# EAGLE design protoboard_demo.v1.1 (EAGLE 5.07)
PROJECT: Protoboard v1.1 (.500 xQFP)
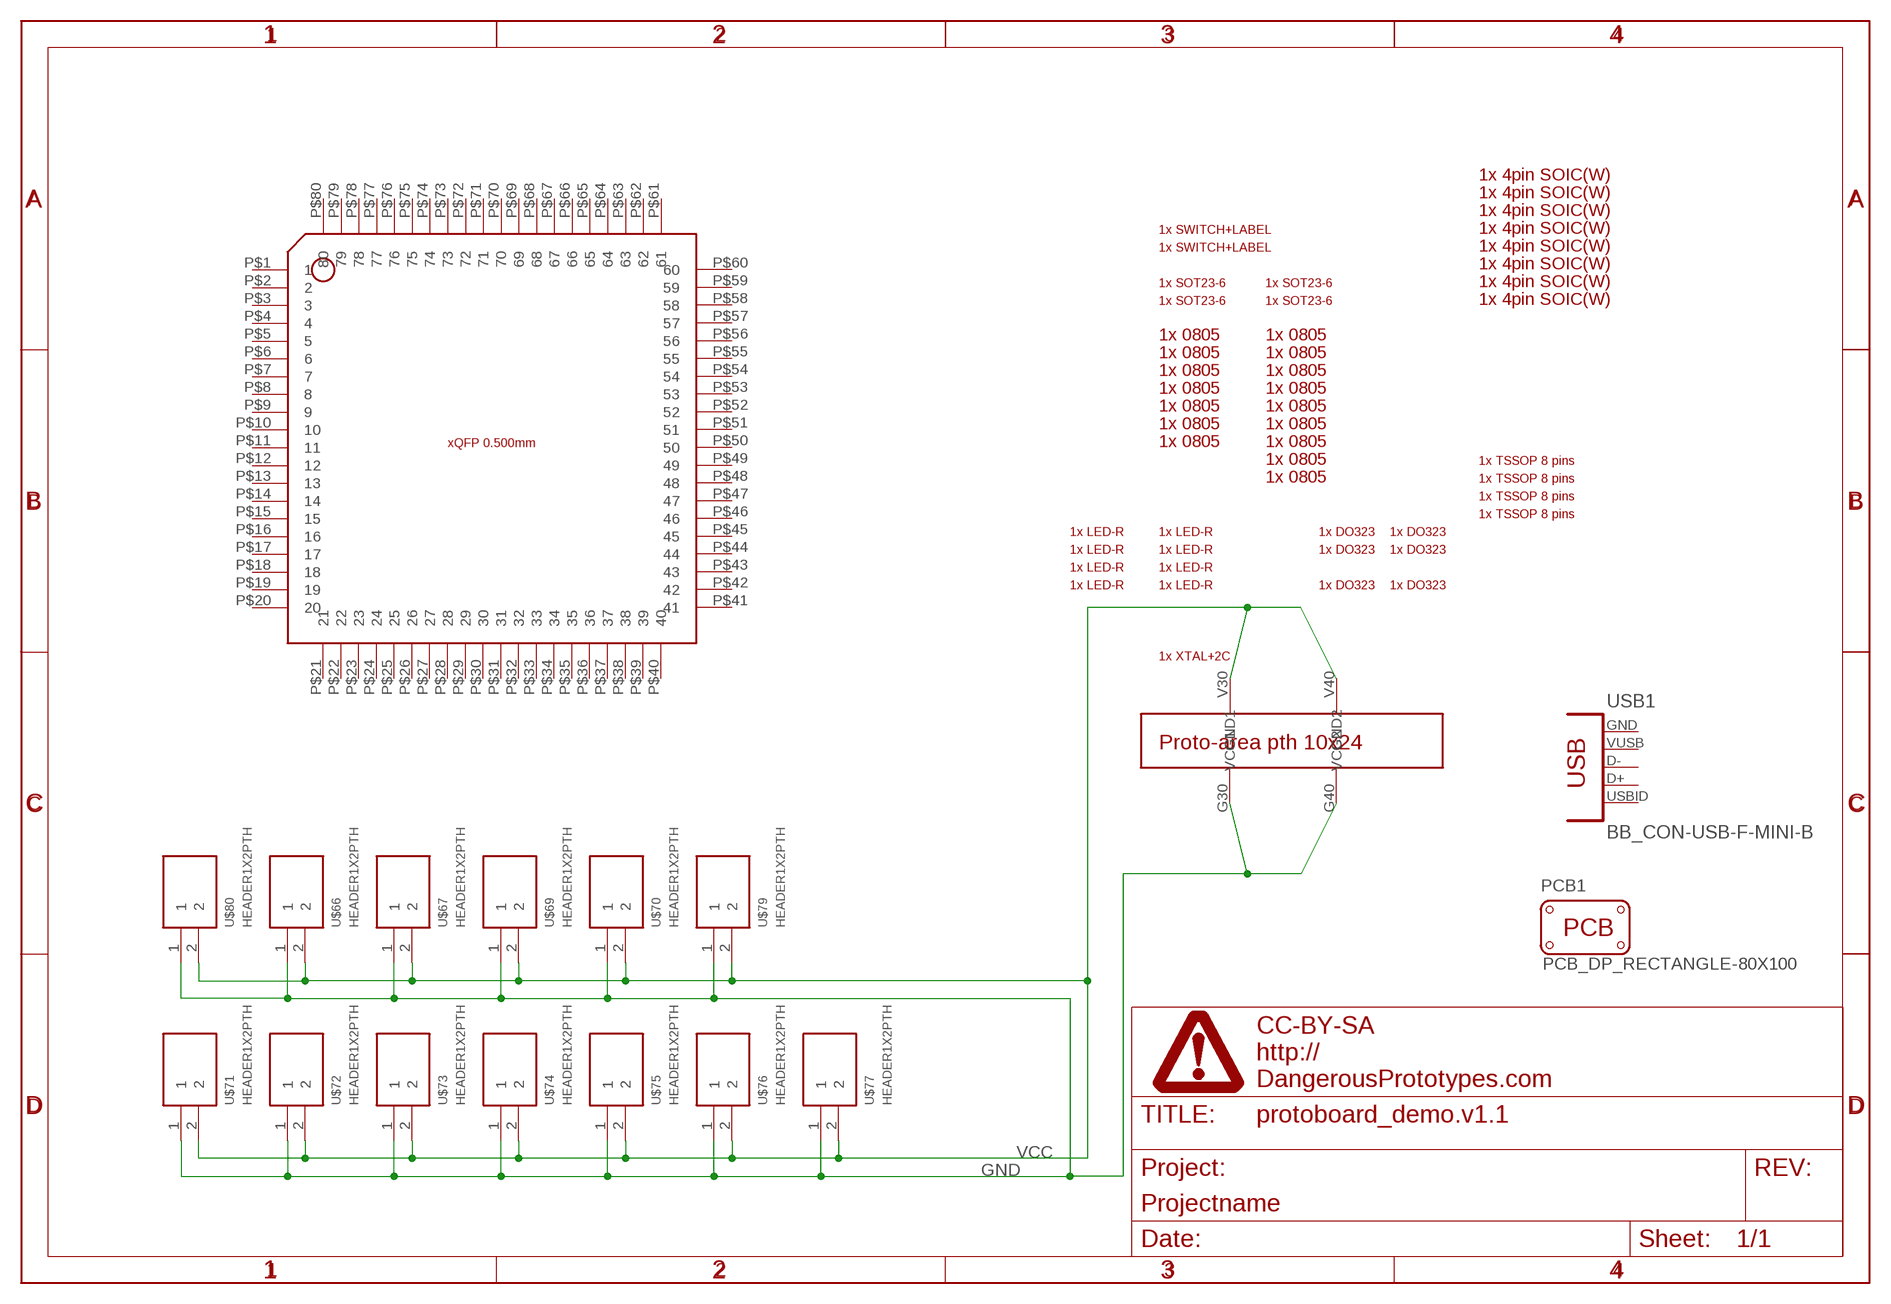
[diagram p0: schematic, sheet 1]

## Parts
PCB1  PCB_DP_RECTANGLE-80X100  [DP10080_V1]
U$1  DINA4_L  [DP_LOGO]
U$2  BB_SOICW  [BB_SOIC]
U$3  BB_SOICW  [BB_SOIC]
U$4  BB_SOICW  [BB_SOIC]
U$5  BB_SOICW  [BB_SOIC]
U$6  BB_SOICW  [BB_SOIC]
U$7  BB_SOICW  [BB_SOIC]
U$8  BB_SOICW  [BB_SOIC]
U$9  BB_SOICW  [BB_SOIC]
U$10  BB_TSSOP_065  [BB_TSSOP_0650]
U$11  BB_TSSOP_065  [BB_TSSOP_0650]
U$12  BB_TSSOP_065  [BB_TSSOP_0650]
U$13  BB_TSSOP_065  [BB_TSSOP_0650]
U$14  BB_SW  [BB_SW]
U$15  BB_SW  [BB_SW]
U$17  BB_SOT23-6  [BB_SOT23-6]
U$18  BB_SOT23-6  [BB_SOT23-6]
U$19  BB_SOT23-6  [BB_SOT23-6]
U$20  PROTO_10X24  [PROTO_10_24]
U$21  BB_RC0805  [BB_RC0805]
U$22  BB_RC0805  [BB_RC0805]
U$23  BB_RC0805  [BB_RC0805]
U$24  BB_RC0805  [BB_RC0805]
U$25  BB_RC0805  [BB_RC0805]
U$26  BB_RC0805  [BB_RC0805]
U$27  BB_XQFP_050BB  [BB_QFP_050_BREAKOUT_BOARD]
U$28  BB_LED  [BB_LED]
U$29  BB_LED  [BB_LED]
U$30  BB_LED  [BB_LED]
U$31  BB_LED  [BB_LED]
U$32  BB_DO323  [BB_DO323]
U$33  BB_DO323  [BB_DO323]
U$35  BB_DO323  [BB_DO323]
U$36  BB_DO323  [BB_DO323]
U$37  BB_DO323  [BB_DO323]
U$39  BB_DO323  [BB_DO323]
U$40  BB_XTAL  [BB_XTAL]
U$41  BB_RC0805  [BB_RC0805]
U$44  BB_SOT23-6  [BB_SOT23-6]
U$45  BB_LED  [BB_LED]
U$46  BB_LED  [BB_LED]
U$47  BB_LED  [BB_LED]
U$48  BB_LED  [BB_LED]
U$54  BB_RC0805  [BB_RC0805]
U$55  BB_RC0805  [BB_RC0805]
U$56  BB_RC0805  [BB_RC0805]
U$57  BB_RC0805  [BB_RC0805]
U$58  BB_RC0805  [BB_RC0805]
U$59  BB_RC0805  [BB_RC0805]
U$60  BB_RC0805  [BB_RC0805]
U$61  BB_RC0805  [BB_RC0805]
U$62  BB_RC0805  [BB_RC0805]
U$66  HEADER1X2PTH  [M1X2]
U$67  HEADER1X2PTH  [M1X2]
U$69  HEADER1X2PTH  [M1X2]
U$70  HEADER1X2PTH  [M1X2]
U$71  HEADER1X2PTH  [M1X2]
U$72  HEADER1X2PTH  [M1X2]
U$73  HEADER1X2PTH  [M1X2]
U$74  HEADER1X2PTH  [M1X2]
U$75  HEADER1X2PTH  [M1X2]
U$76  HEADER1X2PTH  [M1X2]
U$77  HEADER1X2PTH  [M1X2]
U$79  HEADER1X2PTH  [M1X2]
U$80  HEADER1X2PTH  [M1X2]
USB1  BB_CON-USB-F-MINI-B  [BB_CONN_USB_MINI-B]

## Nets
GND: U$20.G30(GND1) U$20.G40(GND2) U$66.1 U$67.1 U$69.1 U$70.1 U$71.1 U$72.1 U$73.1 U$74.1 U$75.1 U$76.1 U$77.1 U$79.1 U$80.1
VCC: U$20.V30(VCC1) U$20.V40(VCC2) U$66.2 U$67.2 U$69.2 U$70.2 U$71.2 U$72.2 U$73.2 U$74.2 U$75.2 U$76.2 U$77.2 U$79.2 U$80.2
Unconnected: U$27.P$1 U$27.P$2 U$27.P$3 U$27.P$4 U$27.P$5 U$27.P$6 U$27.P$7 U$27.P$8 U$27.P$9 U$27.P$10 U$27.P$11 U$27.P$12 U$27.P$13 U$27.P$14 U$27.P$15 U$27.P$16 U$27.P$17 U$27.P$18 U$27.P$19 U$27.P$20 U$27.P$21 U$27.P$22 U$27.P$23 U$27.P$24 U$27.P$25 U$27.P$26 U$27.P$27 U$27.P$28 U$27.P$29 U$27.P$30 U$27.P$31 U$27.P$32 U$27.P$33 U$27.P$34 U$27.P$35 U$27.P$36 U$27.P$37 U$27.P$38 U$27.P$39 U$27.P$40 U$27.P$41 U$27.P$42 U$27.P$43 U$27.P$44 U$27.P$45 U$27.P$46 U$27.P$47 U$27.P$48 U$27.P$49 U$27.P$50 U$27.P$51 U$27.P$52 U$27.P$53 U$27.P$54 U$27.P$55 U$27.P$56 U$27.P$57 U$27.P$58 U$27.P$59 U$27.P$60 U$27.P$61 U$27.P$62 U$27.P$63 U$27.P$64 U$27.P$65 U$27.P$66 U$27.P$67 U$27.P$68 U$27.P$69 U$27.P$70 U$27.P$71 U$27.P$72 U$27.P$73 U$27.P$74 U$27.P$75 U$27.P$76 U$27.P$77 U$27.P$78 U$27.P$79 U$27.P$80 USB1.BODY@1(BODY) USB1.BODY@2(BODY) USB1.BODY@3(BODY) USB1.BODY@4(BODY) USB1.D+ USB1.D- USB1.GND USB1.ID(USBID) USB1.VUSB

## Library data of the parts
PCB1 = dp_devices:PCB_DP_RECTANGLE: Dangerous Prototypes Standard Rectangular PCB sizes
U$1 = dp_devices:DINA4_L: A4 DP frame Standard Dangerous Prototypes schematic frame. Automagically adds the DP logo and standard texts to the PCB Use the atrribute in the schematic editor to change the fields.; FF1: fulfillment by; FF2: Seeed Studio; FF3: www.seeedstudio.com; LICENSE: CC-BY-SA; PROJECT: Projectname; URL1: http://; URL2: DangerousPrototypes.com
U$2-U$9 = DP_protoboard:BB_SOICW
U$10-U$13 = DP_protoboard:BB_TSSOP_065: Use grid 0.650mm to place!
U$14 U$15 = DP_protoboard:BB_SW
U$17-U$19 U$44 = DP_protoboard:BB_SOT23-6
U$20 = DP_protoboard:PROTO_10X24
U$21-U$26 U$41 U$54-U$62 = DP_protoboard:BB_RC0805
U$27 = dp_devices:BB_XQFP_050
U$28-U$31 U$45-U$48 = DP_protoboard:BB_LED
U$32 U$33 U$35-U$37 U$39 = DP_protoboard:BB_DO323
U$40 = DP_protoboard:BB_XTAL
U$66 U$67 U$69-U$77 U$79 U$80 = dp_devices:HEADER1X2
USB1 = DP_protoboard:BB_CON-USB-F: USB Female connector

## Board
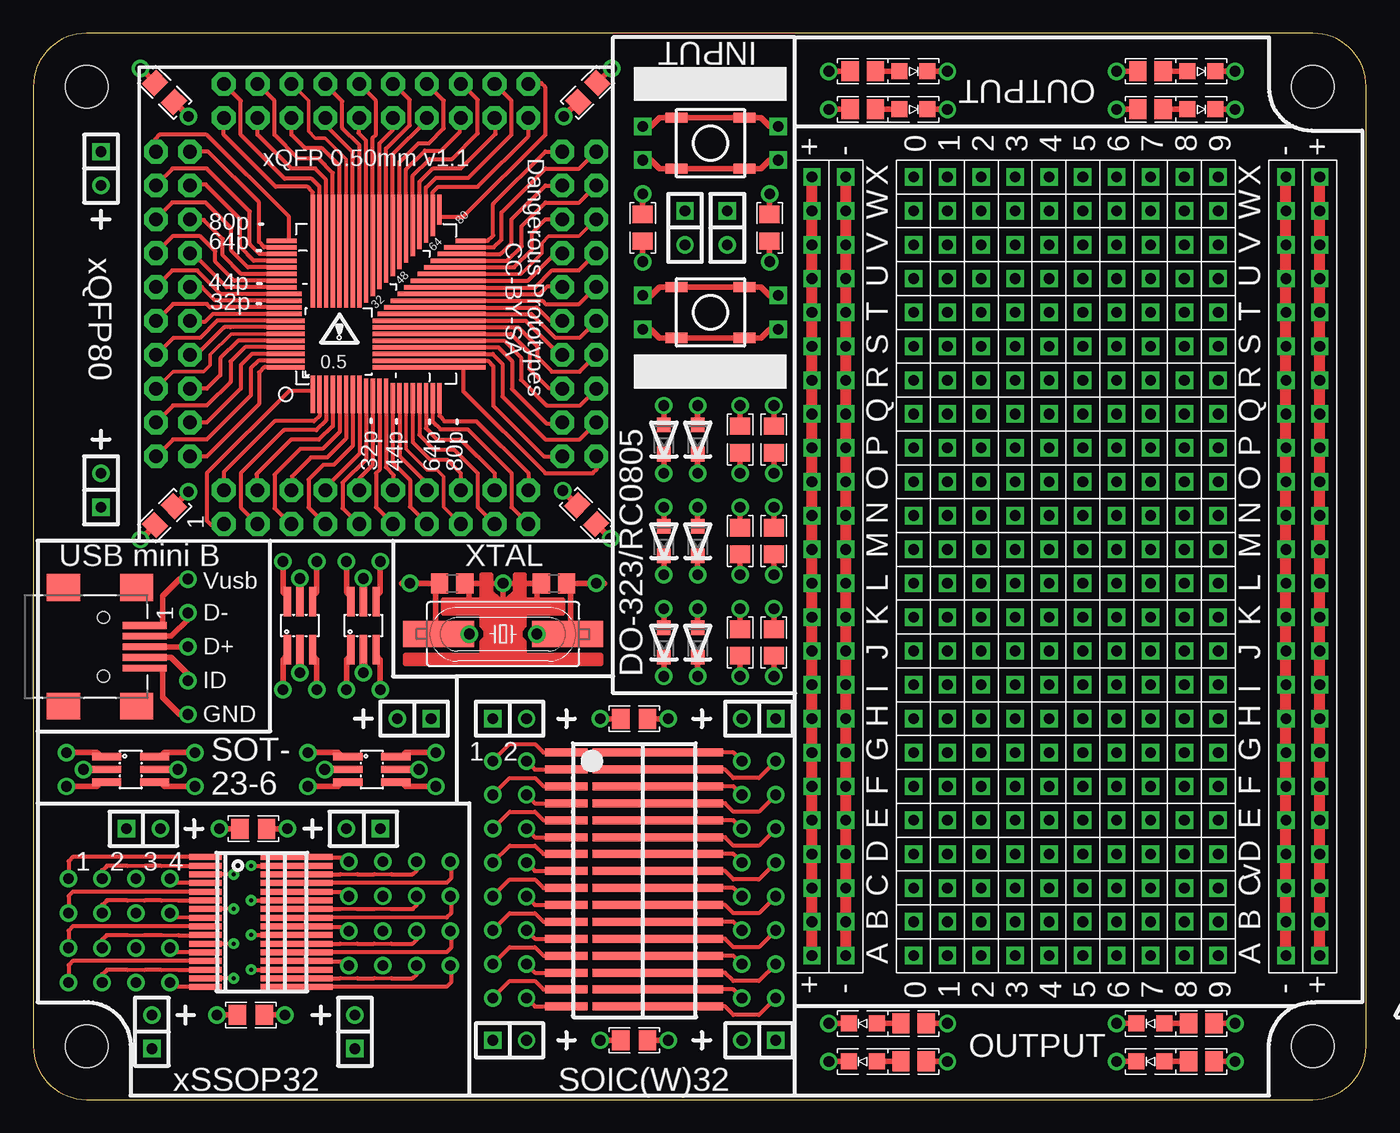
[diagram p1: board, top side]
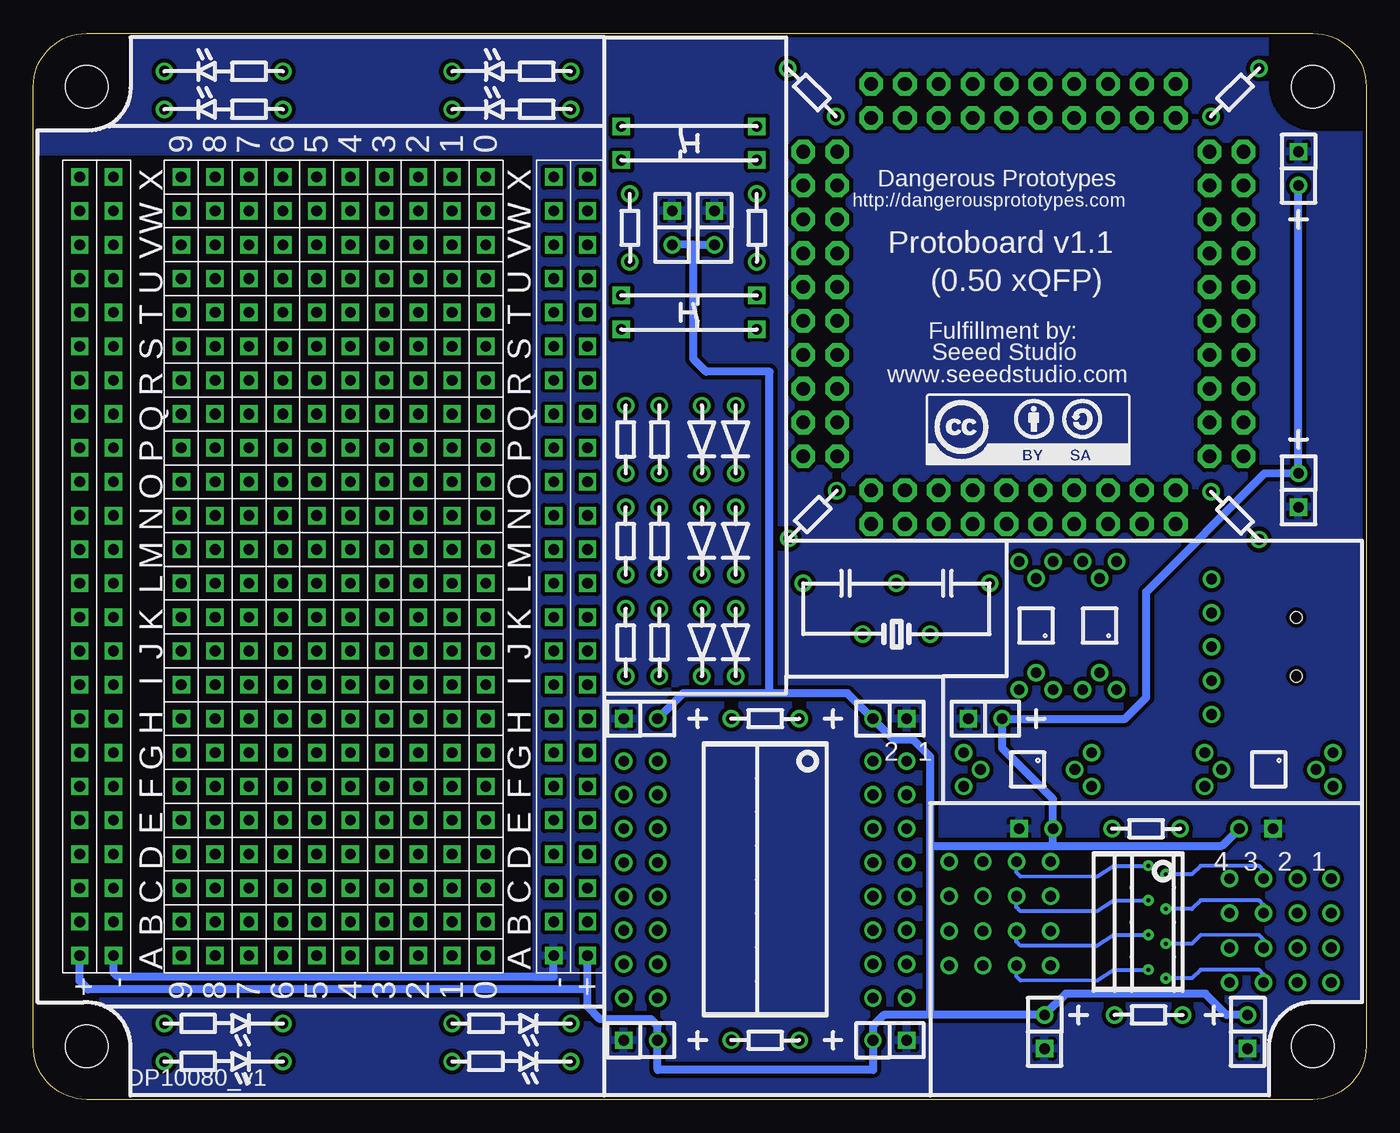
[diagram p2: board, bottom side, seen from below]

Size 100 x 80 mm. Coordinates in mm from the lower left corner, seen from the top.
Copper layers (1*16): Top 0.035mm / dielectric 1.5mm / Bottom 0.035mm
Design rules "Fusion_eagle_rule_v1.1": minimum track width 6mil, minimum drill 12mil, track to track 6mil, track to pad 6mil, pad to pad 6mil, via to via 6mil, smd to smd 0mil, copper to edge 10mil, drill to drill 10mil, minimum pad ring 10mil, minimum via ring 6mil, stop-mask expansion 2mil, vias tented up to drill 100mil, thermal gap 10mil

### Footprints (pad centres in the part's own frame; a part is rotated, then mirrored left to right if it is on the bottom)
DP10080_V1 = hole 3.2: 4,4; 96,4; 96,76; 4,76
BB_SOIC = smd 3.2 x 0.6: P$1 -5.11,0.635; P$2 -5.11,-0.635 | smd 9.8 x 0.6: P$3 1.77,-0.635; P$4 1.77,0.635 | drill 0.8 round: P$5 -8.08,0; P$6 -10.62,0; P$7 8.08,0; P$8 10.62,0
BB_TSSOP_0650 = smd 2.45 x 0.45: P$1 -3.425,0; P$2 -3.425,-0.65; P$7 -3.425,0.65; P$8 -3.425,1.3 | smd 5.4 x 0.45: P$3 3.425,1.3; P$4 3.425,-0.65; P$5 3.425,0; P$6 3.425,0.65 | drill 0.8 round: P$18 -6.08,-0.318; P$21 -8.62,-0.318; P$22 -11.16,-0.318; P$23 -13.7,-0.318; P$24 7.35,0.953; P$28 9.89,0.953; P$29 12.43,0.953; P$30 14.97,0.953 | drill 0.305 round: P$25 -1.285,0; P$26 0.03,0.65
BB_SW = smd 1.651 x 0.762: 1 -2.54,1.905; 2 2.54,1.905; 3 -2.54,-1.905; 4 2.54,-1.905 | drill 0.8 square: P$1 -5.08,1.27; P$2 -5.08,-1.27; P$3 5.08,1.27; P$4 5.08,-1.27
BB_SOT23-6 = smd 0.55 x 2.2: 1 -0.95,-1.8; 2 0,-1.8; 3 0.95,-1.8; 4 0.95,1.8; 5 0,1.8; 6 -0.95,1.8 | drill 0.8 round: P$1 1.27,-4.81; P$2 0,-3.54; P$3 -1.27,-4.81; P$4 0,3.54; P$5 1.27,4.81; P$6 -1.27,4.81
PROTO_10_24 = drill 0.8 square: 1 -29.21,-11.43; 2 -26.67,-11.43; 3 -24.13,-11.43; 4 -21.59,-11.43; 5 -19.05,-11.43; 6 -16.51,-11.43; 7 -13.97,-11.43; 8 -11.43,-11.43; 9 -8.89,-11.43; 10 -6.35,-11.43; 11 -3.81,-11.43; 12 -1.27,-11.43; 13 1.27,-11.43; 14 3.81,-11.43; 15 6.35,-11.43; 16 8.89,-11.43; 17 11.43,-11.43; 18 13.97,-11.43; 19 16.51,-11.43; 20 19.05,-11.43; 21 21.59,-11.43; 22 24.13,-11.43; 23 26.67,-11.43; 24 29.21,-11.43; 25 -29.21,-8.89; 26 -26.67,-8.89; 27 -24.13,-8.89; 28 -21.59,-8.89; 29 -19.05,-8.89; 30 -16.51,-8.89; 31 -13.97,-8.89; 32 -11.43,-8.89; 33 -8.89,-8.89; 34 -6.35,-8.89; 35 -3.81,-8.89; 36 -1.27,-8.89; 37 1.27,-8.89; 38 3.81,-8.89; 39 6.35,-8.89; 40 8.89,-8.89; 41 11.43,-8.89; 42 13.97,-8.89; 43 16.51,-8.89; 44 19.05,-8.89; 45 21.59,-8.89; 46 24.13,-8.89; 47 26.67,-8.89; 48 29.21,-8.89; 49 -29.21,-6.35; 50 -26.67,-6.35; 51 -24.13,-6.35; 52 -21.59,-6.35; 53 -19.05,-6.35; 54 -16.51,-6.35; 55 -13.97,-6.35; 56 -11.43,-6.35; 57 -8.89,-6.35; 58 -6.35,-6.35; 59 -3.81,-6.35; 60 -1.27,-6.35; 61 1.27,-6.35; 62 3.81,-6.35; 63 6.35,-6.35; 64 8.89,-6.35; 65 11.43,-6.35; 66 13.97,-6.35; 67 16.51,-6.35; 68 19.05,-6.35; 69 21.59,-6.35; 70 24.13,-6.35; 71 26.67,-6.35; 72 29.21,-6.35; 73 -29.21,-3.81; 74 -26.67,-3.81; 75 -24.13,-3.81; 76 -21.59,-3.81; 77 -19.05,-3.81; 78 -16.51,-3.81; 79 -13.97,-3.81; 80 -11.43,-3.81; 81 -8.89,-3.81; 82 -6.35,-3.81; 83 -3.81,-3.81; 84 -1.27,-3.81; 85 1.27,-3.81; 86 3.81,-3.81; 87 6.35,-3.81; 88 8.89,-3.81; 89 11.43,-3.81; 90 13.97,-3.81; 91 16.51,-3.81; 92 19.05,-3.81; 93 21.59,-3.81; 94 24.13,-3.81; 95 26.67,-3.81; 96 29.21,-3.81; 97 -29.21,-1.27; 98 -26.67,-1.27; 99 -24.13,-1.27; 100 -21.59,-1.27; 101 -19.05,-1.27; 102 -16.51,-1.27; 103 -13.97,-1.27; 104 -11.43,-1.27; 105 -8.89,-1.27; 106 -6.35,-1.27; 107 -3.81,-1.27; 108 -1.27,-1.27; 109 1.27,-1.27; 110 3.81,-1.27; 111 6.35,-1.27; 112 8.89,-1.27; 113 11.43,-1.27; 114 13.97,-1.27; 115 16.51,-1.27; 116 19.05,-1.27; 117 21.59,-1.27; 118 24.13,-1.27; 119 26.67,-1.27; 120 29.21,-1.27; 121 -29.21,1.27; 122 -26.67,1.27; 123 -24.13,1.27; 124 -21.59,1.27; 125 -19.05,1.27; 126 -16.51,1.27; 127 -13.97,1.27; 128 -11.43,1.27; 129 -8.89,1.27; 130 -6.35,1.27; 131 -3.81,1.27; 132 -1.27,1.27; 133 1.27,1.27; 134 3.81,1.27; 135 6.35,1.27; 136 8.89,1.27; 137 11.43,1.27; 138 13.97,1.27; 139 16.51,1.27; 140 19.05,1.27; 141 21.59,1.27; 142 24.13,1.27; 143 26.67,1.27; 144 29.21,1.27; 145 -29.21,3.81; 146 -26.67,3.81; 147 -24.13,3.81; 148 -21.59,3.81; 149 -19.05,3.81; 150 -16.51,3.81; 151 -13.97,3.81; 152 -11.43,3.81; 153 -8.89,3.81; 154 -6.35,3.81; 155 -3.81,3.81; 156 -1.27,3.81; 157 1.27,3.81; 158 3.81,3.81; 159 6.35,3.81; 160 8.89,3.81; 161 11.43,3.81; 162 13.97,3.81; 163 16.51,3.81; 164 19.05,3.81; 165 21.59,3.81; 166 24.13,3.81; 167 26.67,3.81; 168 29.21,3.81; 169 -29.21,6.35; 170 -26.67,6.35; 171 -24.13,6.35; 172 -21.59,6.35; 173 -19.05,6.35; 174 -16.51,6.35; 175 -13.97,6.35; 176 -11.43,6.35; 177 -8.89,6.35; 178 -6.35,6.35; 179 -3.81,6.35; 180 -1.27,6.35; 181 1.27,6.35; 182 3.81,6.35; 183 6.35,6.35; 184 8.89,6.35; 185 11.43,6.35; 186 13.97,6.35; 187 16.51,6.35; 188 19.05,6.35; 189 21.59,6.35; 190 24.13,6.35; 191 26.67,6.35; 192 29.21,6.35; 193 -29.21,8.89; 194 -26.67,8.89; 195 -24.13,8.89; 196 -21.59,8.89; 197 -19.05,8.89; 198 -16.51,8.89; 199 -13.97,8.89; 200 -11.43,8.89; 201 -8.89,8.89; 202 -6.35,8.89; 203 -3.81,8.89; 204 -1.27,8.89; 205 1.27,8.89; 206 3.81,8.89; 207 6.35,8.89; 208 8.89,8.89; 209 11.43,8.89; 210 13.97,8.89; 211 16.51,8.89; 212 19.05,8.89; 213 21.59,8.89; 214 24.13,8.89; 215 26.67,8.89; 216 29.21,8.89; 217 -29.21,11.43; 218 -26.67,11.43; 219 -24.13,11.43; 220 -21.59,11.43; 221 -19.05,11.43; 222 -16.51,11.43; 223 -13.97,11.43; 224 -11.43,11.43; 225 -8.89,11.43; 226 -6.35,11.43; 227 -3.81,11.43; 228 -1.27,11.43; 229 1.27,11.43; 230 3.81,11.43; 231 6.35,11.43; 232 8.89,11.43; 233 11.43,11.43; 234 13.97,11.43; 235 16.51,11.43; 236 19.05,11.43; 237 21.59,11.43; 238 24.13,11.43; 239 26.67,11.43; 240 29.21,11.43; G30 -29.21,16.51; G31 -26.67,16.51; G32 -24.13,16.51; G33 -21.59,16.51; G34 -19.05,16.51; G35 -16.51,16.51; G36 -13.97,16.51; G37 -11.43,16.51; G38 -8.89,16.51; G39 -6.35,16.51; G40 -29.21,-16.51; G41 -26.67,-16.51; G42 -24.13,-16.51; G43 -21.59,-16.51; G44 -19.05,-16.51; G45 -16.51,-16.51; G46 -13.97,-16.51; G47 -11.43,-16.51; G48 -8.89,-16.51; G49 -6.35,-16.51; G310 -3.81,16.51; G311 -1.27,16.51; G312 1.27,16.51; G313 3.81,16.51; G314 6.35,16.51; G315 8.89,16.51; G316 11.43,16.51; G317 13.97,16.51; G318 16.51,16.51; G319 19.05,16.51; G320 21.59,16.51; G321 24.13,16.51; G322 26.67,16.51; G323 29.21,16.51; G410 -3.81,-16.51; G411 -1.27,-16.51; G412 1.27,-16.51; G413 3.81,-16.51; G414 6.35,-16.51; G415 8.89,-16.51; G416 11.43,-16.51; G417 13.97,-16.51; G418 16.51,-16.51; G419 19.05,-16.51; G420 21.59,-16.51; G421 24.13,-16.51; G422 26.67,-16.51; G423 29.21,-16.51; V30 -29.21,19.05; V31 -26.67,19.05; V32 -24.13,19.05; V33 -21.59,19.05; V34 -19.05,19.05; V35 -16.51,19.05; V36 -13.97,19.05; V37 -11.43,19.05; V38 -8.89,19.05; V39 -6.35,19.05; V40 -29.21,-19.05; V41 -26.67,-19.05; V42 -24.13,-19.05; V43 -21.59,-19.05; V44 -19.05,-19.05; V45 -16.51,-19.05; V46 -13.97,-19.05; V47 -11.43,-19.05; V48 -8.89,-19.05; V49 -6.35,-19.05; V310 -3.81,19.05; V311 -1.27,19.05; V312 1.27,19.05; V313 3.81,19.05; V314 6.35,19.05; V315 8.89,19.05; V316 11.43,19.05; V317 13.97,19.05; V318 16.51,19.05; V319 19.05,19.05; V320 21.59,19.05; V321 24.13,19.05; V322 26.67,19.05; V323 29.21,19.05; V410 -3.81,-19.05; V411 -1.27,-19.05; V412 1.27,-19.05; V413 3.81,-19.05; V414 6.35,-19.05; V415 8.89,-19.05; V416 11.43,-19.05; V417 13.97,-19.05; V418 16.51,-19.05; V419 19.05,-19.05; V420 21.59,-19.05; V421 24.13,-19.05; V422 26.67,-19.05; V423 29.21,-19.05
BB_RC0805 = smd 1.3 x 1.5: P$1 -1,0; P$2 1,0 | drill 0.8 round: P$3 -2.54,0; P$4 2.54,0
BB_QFP_050_BREAKOUT_BOARD = smd 0.33 x 2.824: 1 -4.75,-6.788; 2 -4.25,-6.788; 3 -3.75,-6.788; 4 -3.25,-6.788; 5 -2.75,-6.788; 6 -2.25,-6.788; 7 -1.75,-6.788; 8 -1.25,-6.788 | smd 0.33 x 2.6: 9 -0.75,-6.9; 10 -0.25,-6.9; 11 0.25,-6.9; 12 0.75,-6.9 | smd 0.33 x 2.25: 13 1.25,-7.075; 14 1.75,-7.075; 15 2.25,-7.075; 16 2.75,-7.075; 17 3.25,-7.075; 18 3.75,-7.075; 19 4.25,-7.075; 20 4.75,-7.075; 41 4.75,7.075 | smd 8.47 x 0.33: 21 3.965,-4.75; 22 3.965,-4.25; 23 3.965,-3.75; 24 3.965,-3.25; 25 3.965,-2.75; 26 3.965,-2.25; 27 3.965,-1.75; 28 3.965,-1.25 | smd 8.1 x 0.33: 29 4.15,-0.75 | smd 7.6 x 0.33: 30 4.4,-0.25 | smd 7.1 x 0.33: 31 4.65,0.25 | smd 6.6 x 0.33: 32 4.9,0.75 | smd 6.1 x 0.33: 33 5.15,1.25 | smd 5.6 x 0.33: 34 5.4,1.75 | smd 5.1 x 0.33: 35 5.65,2.25 | smd 4.6 x 0.33: 36 5.9,2.75 | smd 4.1 x 0.33: 37 6.15,3.25 | smd 3.6 x 0.33: 38 6.4,3.75 | smd 3.1 x 0.33: 39 6.65,4.25 | smd 2.25 x 0.33: 40 7.075,4.75; 61 -7.075,4.75; 62 -7.075,4.25; 63 -7.075,3.75; 64 -7.075,3.25; 65 -7.075,2.75; 66 -7.075,2.25; 67 -7.075,1.75; 68 -7.075,1.25 | smd 0.33 x 3.1: 42 4.25,6.65 | smd 0.33 x 3.6: 43 3.75,6.4 | smd 0.33 x 4.1: 44 3.25,6.15 | smd 0.33 x 4.6: 45 2.75,5.9 | smd 0.33 x 5.1: 46 2.25,5.65 | smd 0.33 x 5.6: 47 1.75,5.4 | smd 0.33 x 6.1: 48 1.25,5.15 | smd 0.33 x 6.6: 49 0.75,4.9 | smd 0.33 x 7.1: 50 0.25,4.65 | smd 0.33 x 7.6: 51 -0.25,4.4 | smd 0.33 x 8.1: 52 -0.75,4.15 | smd 0.33 x 8.47: 53 -1.25,3.965; 54 -1.75,3.965; 55 -2.25,3.965; 56 -2.75,3.965; 57 -3.25,3.965; 58 -3.75,3.965; 59 -4.25,3.965; 60 -4.75,3.965 | smd 2.6 x 0.33: 69 -6.9,0.75; 70 -6.9,0.25; 71 -6.9,-0.25; 72 -6.9,-0.75 | smd 2.824 x 0.33: 73 -6.788,-1.25; 74 -6.788,-1.75; 75 -6.788,-2.25; 76 -6.788,-2.75; 77 -6.788,-3.25; 78 -6.788,-3.75; 79 -6.788,-4.25; 80 -6.788,-4.75 | drill 1.016 pad 1.778 octagon: P$1 -11.43,-16.51; P$2 -11.43,-13.97; P$3 -8.89,-16.51; P$4 -8.89,-13.97; P$5 -6.35,-16.51; P$6 -6.35,-13.97; P$7 -3.81,-16.51; P$8 -3.81,-13.97; P$9 -1.27,-16.51; P$10 -1.27,-13.97; P$11 1.27,-16.51; P$12 1.27,-13.97; P$13 3.81,-16.51; P$14 3.81,-13.97; P$15 6.35,-16.51; P$16 6.35,-13.97; P$17 8.89,-16.51; P$18 8.89,-13.97; P$19 11.43,-16.51; P$20 11.43,-13.97; P$21 16.51,-11.43; P$22 13.97,-11.43; P$23 16.51,-8.89; P$24 13.97,-8.89; P$25 16.51,-6.35; P$26 13.97,-6.35; P$27 16.51,-3.81; P$28 13.97,-3.81; P$29 16.51,-1.27; P$30 13.97,-1.27; P$31 16.51,1.27; P$32 13.97,1.27; P$33 16.51,3.81; P$34 13.97,3.81; P$35 16.51,6.35; P$36 13.97,6.35; P$37 16.51,8.89; P$38 13.97,8.89; P$39 16.51,11.43; P$40 13.97,11.43; P$41 11.43,16.51; P$42 11.43,13.97; P$43 8.89,16.51; P$44 8.89,13.97; P$45 6.35,16.51; P$46 6.35,13.97; P$47 3.81,16.51; P$48 3.81,13.97; P$49 1.27,16.51; P$50 1.27,13.97; P$51 -1.27,16.51; P$52 -1.27,13.97; P$53 -3.81,16.51; P$54 -3.81,13.97; P$55 -6.35,16.51; P$56 -6.35,13.97; P$57 -8.89,16.51; P$58 -8.89,13.97; P$59 -11.43,16.51; P$60 -11.43,13.97; P$61 -16.51,11.43; P$62 -13.97,11.43; P$63 -16.51,8.89; P$64 -13.97,8.89; P$65 -16.51,6.35; P$66 -13.97,6.35; P$67 -16.51,3.81; P$68 -13.97,3.81; P$69 -16.51,1.27; P$70 -13.97,1.27; P$71 -16.51,-1.27; P$72 -13.97,-1.27; P$73 -16.51,-3.81; P$74 -13.97,-3.81; P$75 -16.51,-6.35; P$76 -13.97,-6.35; P$77 -16.51,-8.89; P$78 -13.97,-8.89; P$79 -16.51,-11.43; P$80 -13.97,-11.43
BB_LED = smd 1.3 x 1.5: 1 -4.76,0; 2 -2.86,0 | smd 1.2 x 1.2: A -1.05,0; C 1.05,0 | drill 0.8 round: P$1 2.54,0; P$2 -6.35,0
BB_DO323 = smd 1.1 x 1: A 1.1,0; C -1.1,0 | drill 0.8 round: P$1 -2.54,0; P$2 2.54,0
BB_XTAL = smd 5.334 x 1.93: 1 -4.826,-2.54; 2 4.826,-2.54 | smd 1.3 x 1.5: 3 -4.76,1.27; 4 -2.86,1.27; 5 2.86,1.27; 6 4.76,1.27 | drill 0.8 round: P$1 -6.985,1.27; P$2 6.985,1.27; P$3 0,1.27; P$4 -2.54,-2.54; P$5 2.54,-2.54
M1X2 = drill 0.8 square: 1 -1.27,0 | drill 0.8 round: 2 1.27,0
BB_CONN_USB_MINI-B = smd 2 x 2.5: BODY@1 -4.45,2.5; BODY@2 4.45,2.5; BODY@3 4.45,-3; BODY@4 -4.45,-3 | smd 0.5 x 3.3: D+ 0,3.1; D- -0.8,3.1; GND 1.6,3.1; ID 0.8,3.1; VUSB -1.6,3.1 | drill 0.8 round: P$1 -5.08,6.35; P$2 -2.54,6.35; P$3 0,6.35; P$4 2.54,6.35; P$5 5.08,6.35 | hole 0.9: -2.2,0; 2.2,0

### Placement (x,y rotation side)
PCB1  0,0 0 top
U$1  103.82,6.67 0 top  (outside the outline)
U$2  45.09,12.7 0 top
U$3  45.09,17.78 0 top
U$4  45.09,15.24 0 top
U$5  45.09,20.32 0 top
U$6  45.09,10.16 0 top
U$7  45.09,22.86 0 top
U$8  45.09,7.62 0 top
U$9  45.09,25.4 0 top
U$10  16.32,9.1 0 top
U$11  16.32,11.7 0 top
U$12  16.32,14.29 0 top
U$13  16.32,16.89 0 top
U$14  50.8,71.75 180 top
U$15  50.8,59.05 0 top
U$17  25.4,24.77 270 top
U$18  7.3,24.77 270 top
U$19  24.77,35.56 0 top
U$20  77.47,40.01 90 top
U$21  41.59,75.56 45 top
U$22  45.72,65.41 90 top
U$23  9.84,43.81 45 top
U$24  41.52,43.89 135 top
U$25  9.84,75.56 135 top
U$26  55.24,65.41 270 top
U$27  25.72,59.69 0 top
U$28  83.82,2.86 180 top
U$29  83.82,5.71 180 top
U$30  62.23,5.71 180 top
U$31  62.23,2.86 180 top
U$32  47.31,41.91 90 top
U$33  47.31,34.29 90 top
U$34  [CC-BY-SA]  33.02,47.62 0 bottom
U$35  49.85,49.53 90 top
U$36  49.85,41.91 90 top
U$37  49.85,34.29 90 top
U$39  47.31,49.53 90 top
U$40  35.24,37.47 0 top
U$41  55.56,34.29 90 top
U$44  20,35.56 0 top
U$45  87.63,77.15 0 top
U$46  87.63,74.3 0 top
U$47  66.04,77.15 0 top
U$48  66.04,74.3 0 top
U$54  55.56,49.53 90 top
U$55  53.02,49.53 90 top
U$56  45.09,4.45 180 top
U$57  45.09,28.57 0 top
U$58  53.02,34.29 90 top
U$59  16.32,6.35 0 top
U$60  16.51,20.32 0 top
U$61  55.56,41.91 90 top
U$62  53.02,41.91 90 top
U$66  52.07,65.41 270 top
U$67  5.08,69.85 270 top
U$69  54.44,4.45 180 top
U$70  28.57,28.57 180 top
U$71  8.89,5.08 90 top
U$72  24.13,5.08 90 top
U$73  24.77,20.32 180 top
U$74  8.26,20.32 0 top
U$75  35.73,4.45 0 top
U$76  48.9,65.41 270 top
U$77  54.44,28.57 180 top
U$79  35.73,28.57 0 top
U$80  5.08,45.72 90 top
USB1  5.25,33.97 270 top

### Tracks (layer width: path | path; a pad name or v marks a point on that pad's centre or on a via)
GND
  Bottom 0.61: U$20.G40 93.98,9.53 93.66,9.21 60.96,9.21 U$20.G30
  pour Bottom (isolate 0.305): 0,0 100.33,0 100.33,8.89 62.23,8.89 62.23,71.12 99.69,71.12 99.69,80.01 0,80.01
VCC
  Bottom 0.61: 50.48,64.14 U$76.2 | 50.48,64.14 U$66.2 | U$20.V40 96.52,8.89 95.89,8.26 58.42,8.26 | 58.42,8.26 58.42,6.99 57.47,6.03 53.66,6.03 53.16,5.54 U$69.2 53.16,2.22 37.01,2.22 U$75.2 37.01,5.54 36.2,6.35 32.7,6.35 | 58.42,8.26 U$20.V30 | U$71.2 10.48,6.35 12.06,7.94 22.54,7.94 U$72.2 32.7,6.35 | U$74.2 10.79,19.05 23.5,19.05 | 32.7,6.35 32.7,19.05 | 32.7,19.05 23.5,19.05 | 23.5,19.05 U$73.2 23.5,22.54 27.3,26.35 U$70.2 18.1,28.57 16.51,30.16 16.51,38.1 7.62,46.99 U$80.2 U$67.2 | U$77.2 51.26,30.48 44.77,30.48 | 44.77,30.48 44.77,54.61 49.53,54.61 50.48,55.56 50.48,64.14 | 32.7,19.05 32.7,25.72 33.97,26.99 35.42,26.99 U$79.2 38.91,30.48 44.77,30.48

### Text on the board
tPlace: INPUT | OUTPUT | xQFP80 | USB mini B | XTAL | DO-323/RC0805 | SOT- | 1 | 2 | 23-6 | 1 | 2 | 3 | 4 | v | OUTPUT | xSSOP32 | SOIC(W)32
bPlace: 1 | 2 | 1 | 2 | 3 | 4
bNames: Protoboard v1.1 | (0.50 xQFP)